# EAGLE design MicroMod-Datalogging-CarrierBoard (EAGLE 9.6.2)
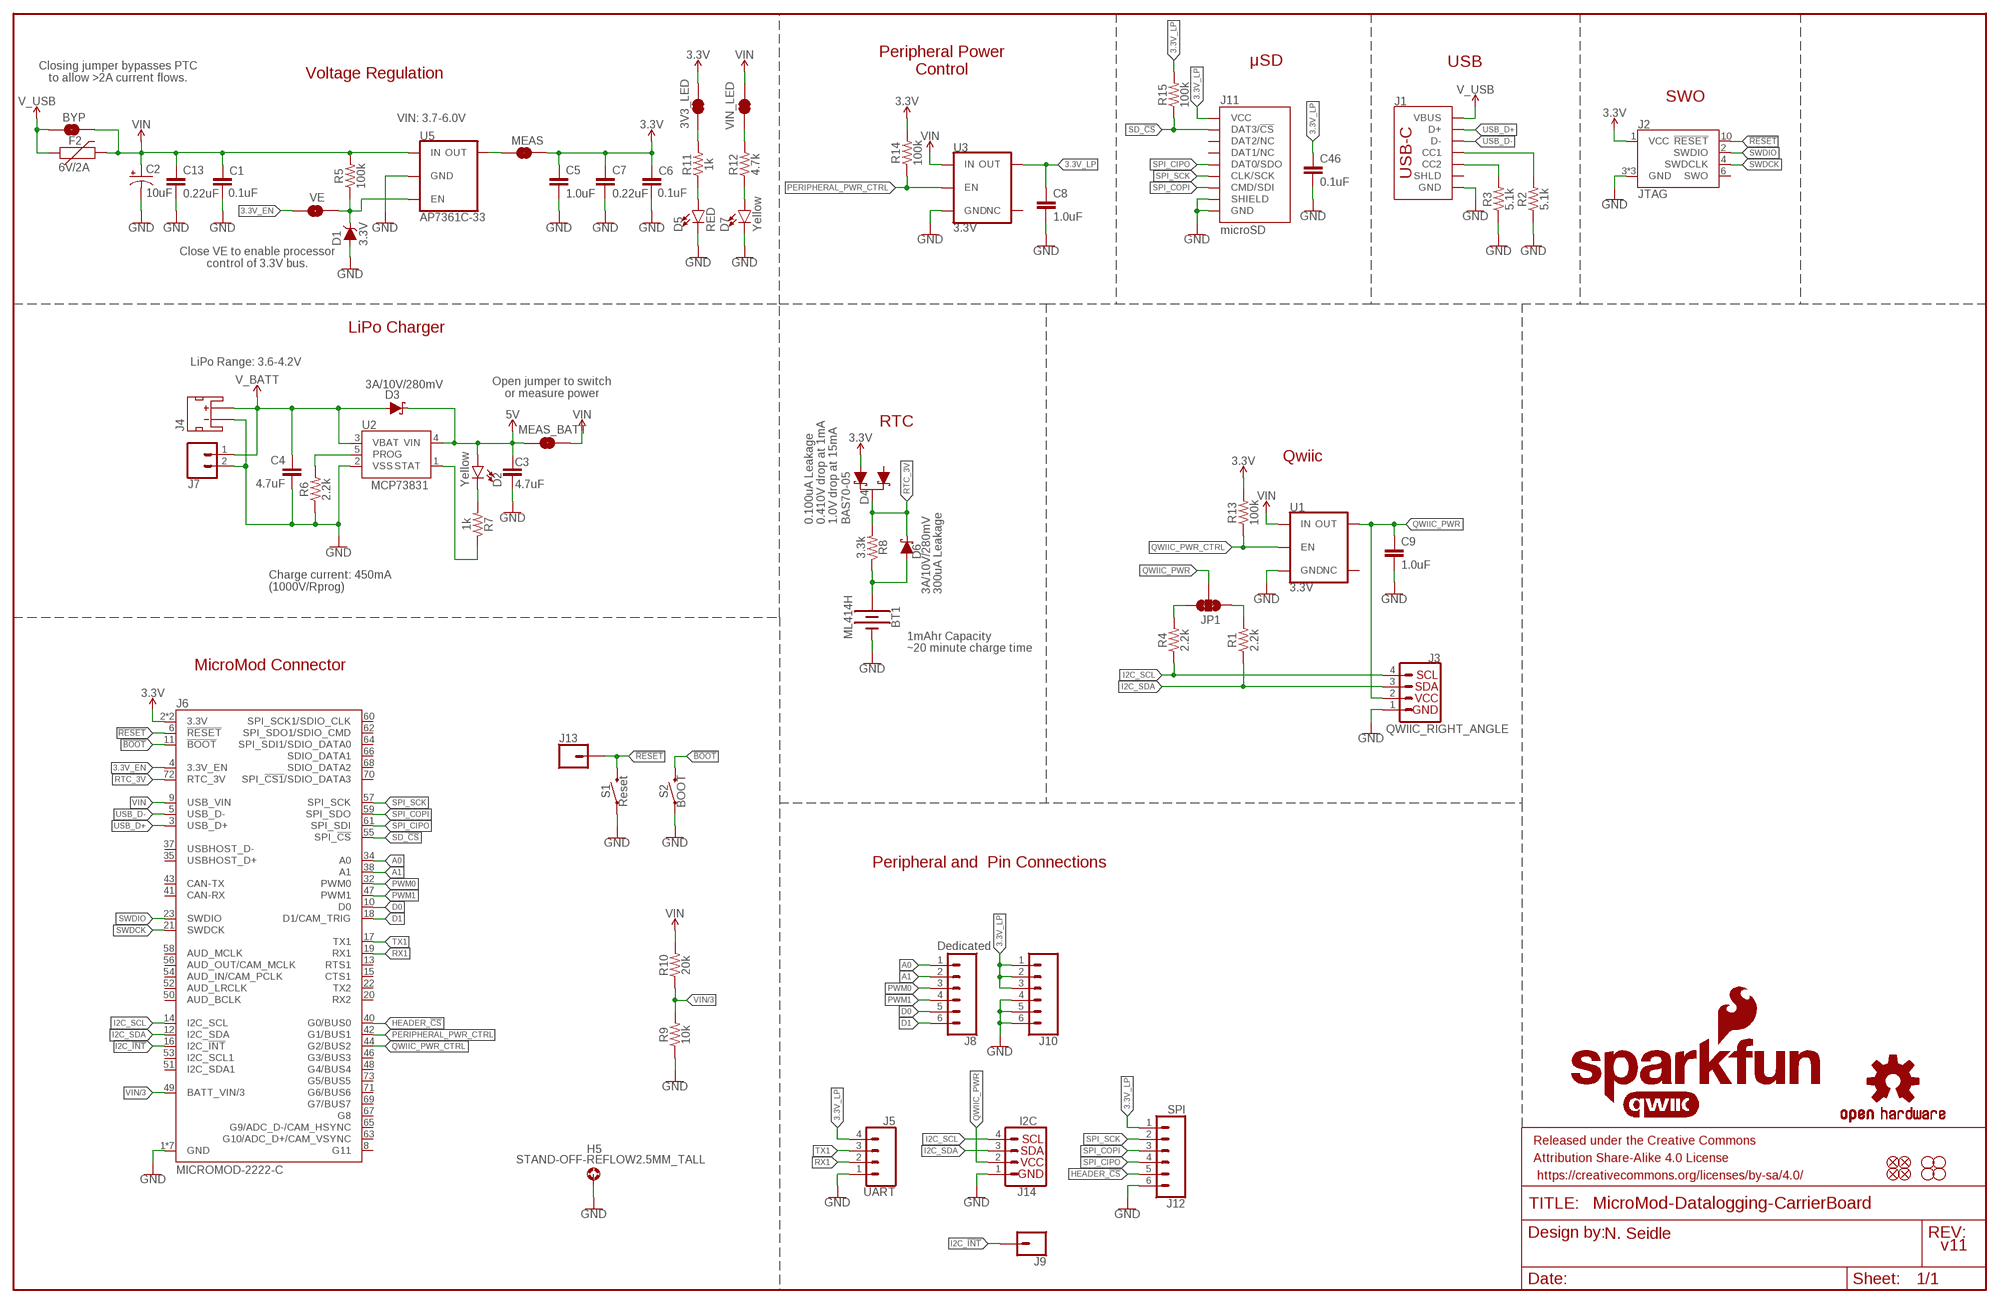
[diagram p0: schematic, sheet 1]

## Parts
3V3_LED  JUMPER-SMT_2_NC_TRACE_SILK  [SMT-JUMPER_2_NC_TRACE_SILK]
BT1  ML414H  ML414H_IV01E_BATTERY  [ML414H_IV01E]
BYP  JUMPER-SMT_2_NO_SILK  [SMT-JUMPER_2_NO_SILK]
C1  0.1uF  0.1UF-0603-25V-(+80/-20%)  [0603]
C2  10uF  10UF-POLAR-EIA3216-16V-10%(TANT)  [EIA3216]
C3  4.7uF  4.7UF-0603-35V-(20%)  [0603]
C4  4.7uF  4.7UF-0603-6.3V-(10%)  [0603]
C5  1.0uF  1.0UF-0603-16V-10%  [0603]
C6  0.1uF  0.1UF-0603-25V-(+80/-20%)  [0603]
C7  0.22uF  0.22UF-0603-25V-10%  [0603]
C8  1.0uF  1.0UF-0603-16V-10%  [0603]
C9  1.0uF  1.0UF-0603-16V-10%  [0603]
C13  0.22uF  0.22UF-0603-25V-10%  [0603]
C46  0.1uF  0.1UF-0603-25V-(+80/-20%)  [0603]
D1  3.3V  DIODE-ZENER-MM3Z3V3T1G  [SOD-323]
D2  Yellow  LED-YELLOW0603  [LED-0603]
D3  3A/10V/280mV  DIODE-SCHOTTKY-BAT60A  [SOD-323]
D4  BAS70-05  DIODE-SCHOTTKY-DUAL  [SOT23-3]
D5  RED  LED-RED0603  [LED-0603]
D6  3A/10V/280mV  DIODE-SCHOTTKY-BAT60A  [SOD-323]
D7  Yellow  LED-YELLOW0603  [LED-0603]
F2  6V/2A  PPTC_6V2A  [1210]
FD1  FIDUCIALUFIDUCIAL  [FIDUCIAL-MICRO]
FD2  FIDUCIALUFIDUCIAL  [FIDUCIAL-MICRO]
FD3  FIDUCIALUFIDUCIAL  [FIDUCIAL-MICRO]
FD4  FIDUCIALUFIDUCIAL  [FIDUCIAL-MICRO]
FRAME1  FRAME-LEDGER  [CREATIVE_COMMONS]
H1  STAND-OFF  [STAND-OFF]
H2  STAND-OFF  [STAND-OFF]
H3  STAND-OFF  [STAND-OFF]
H4  STAND-OFF  [STAND-OFF]
H5  STAND-OFF-REFLOW2.5MM_TALL  [STAND-OFF-REFLOW-M2.5]
J1  USB_C_2-LAYER_PADS  [USB-C-16P-2LAYER-PADS]
J2  JTAG  CORTEX_JTAG_DEBUG_MINIMUM_PTH  [2X5-PTH-1.27MM]
J3  QWIIC_RIGHT_ANGLE  QWIIC_CONNECTORJS-1MM  [JST04_1MM_RA]
J4  JST_2MM_MALE  [JST-2-SMD]
J5  UART  CONN_041X04_NO_SILK  [1X04_NO_SILK]
J6  MICROMOD-2222-C  [M.2-CONNECTOR-E]
J7  CONN_021X02_NO_SILK  [1X02_NO_SILK]
J8  Dedicated  CONN_06NO_SILK_NO_POP  [1X06_NO_SILK]
J9  CONN_01PTH_NO_SILK_YES_STOP  [1X01_NO_SILK]
J10  CONN_06NO_SILK_NO_POP  [1X06_NO_SILK]
J11  microSD  MICRO-SD-SDIOPUSH-PUSH  [MICRO-SD-SOCKET]
J12  SPI  CONN_06NO_SILK_NO_POP  [1X06_NO_SILK]
J13  CONN_01PTH_NO_SILK_YES_STOP  [1X01_NO_SILK]
J14  I2C  I2C_STANDARD_NO_SILK  [1X04_NO_SILK]
JP1  JUMPER-SMT_3_2-NC_TRACE_SILK  [SMT-JUMPER_3_2-NC_TRACE_SILK]
LOGO1  SFE_LOGO_NAME_FLAME.1_INCH  [SFE_LOGO_NAME_FLAME_.1]
LOGO2  QWIIC_LOGO_CONNECTOR  [QWIIC_5.5MM]
LOGO3  OSHW-LOGOMINI  [OSHW-LOGO-MINI]
MEAS  JUMPER-COMBO_2_NC_TRACE  [COMBO-JUMPER_2_NC_TRACE]
MEAS_BATT  JUMPER-COMBO_2_NC_TRACE  [COMBO-JUMPER_2_NC_TRACE]
R1  2.2k  2.2KOHM-0603-1/10W-1%  [0603]
R2  5.1k  5.1KOHM5.1KOHM-0603-1/10W-1%  [0603]
R3  5.1k  5.1KOHM5.1KOHM-0603-1/10W-1%  [0603]
R4  2.2k  2.2KOHM-0603-1/10W-1%  [0603]
R5  100k  100KOHM-0603-1/10W-1%  [0603]
R6  2.2k  2.2KOHM-0603-1/10W-1%  [0603]
R7  1k  1KOHM-0603-1/10W-1%  [0603]
R8  3.3k  3.3KOHM-0603-1/10W-1%  [0603]
R9  10k  10KOHM-0603-1/10W-1%  [0603]
R10  20k  20KOHM-0603-1/10W-1%  [0603]
R11  1k  1KOHM-0603-1/10W-1%  [0603]
R12  4.7k  4.7KOHM-0603-1/10W-1%  [0603]
R13  100k  100KOHM-0603-1/10W-1%  [0603]
R14  100k  100KOHM-0603-1/10W-1%  [0603]
R15  100k  100KOHM-0603-1/10W-1%  [0603]
S1  Reset  MOMENTARY-SWITCH-SPST-SMD-5.2-TALL-REDUNDANT  [TACTILE_SWITCH_SMD_5.2MM]
S2  BOOT  MOMENTARY-SWITCH-SPST-SMD-5.2-TALL-REDUNDANT  [TACTILE_SWITCH_SMD_5.2MM]
U1  3.3V  V_REG_AP2112K-3.3V  [SOT23-5]
U2  MCP73831  [SOT23-5]
U3  3.3V  V_REG_AP2112K-3.3V  [SOT23-5]
U5  AP7361C-33  AP7361C-33FGEUDFN-8  [UDFN-8]
VE  JUMPER-SMT_2_NO_SILK  [SMT-JUMPER_2_NO_SILK]
VIN_LED  JUMPER-SMT_2_NC_TRACE_SILK  [SMT-JUMPER_2_NC_TRACE_SILK]

## Nets
3.3V: 3V3_LED.2 C5.1 C6.1 C7.1 D4.2(A1) J2.1(VCC) J6.2(3.3V) J6.74(3.3V) MEAS.2 MEAS.4 R13.2 R14.2
3.3V_EN: J6.4(3.3V_EN) VE.1
3.3V_EN_VE: D1.C R5.1 U5.5(EN) VE.2
3.3V_LP: C8.1 C46.1 J5.4 J10.1 J10.2 J10.3 J11.VCC J12.1 R15.2 U3.5(OUT)
5V: C3.1 D2.A D3.C MEAS_BATT.1 MEAS_BATT.3 U2.4(VIN)
!BOOT!: J6.11(!BOOT!) S2.3 S2.4
!RESET!: J2.10(!RESET) J6.6(!RESET!) J13.1 S1.3 S1.4
A0: J6.34(A0) J8.1
A1: J6.38(A1) J8.2
CHG_LED: R7.1 U2.1(STAT)
D0: J6.10(D0) J8.5
D1: J6.18(D1/CAM_TRIG) J8.6
GND: BT1.- C1.2 C2.- C3.2 C4.2 C5.2 C6.2 C7.2 C8.2 C9.2 C13.2 C46.2 D1.A D5.C D7.C H5.1 J1.GND J1.GND2(GND) J2.3(GND) J2.5(GND) J2.9(GND) J3.1 J4.1(-) J5.1 J6.1(GND) J6.7(GND) J6.33(GND) J6.36(GND) J6.39(GND) J6.45(GND) J6.75(GND) J7.2 J10.4 J10.5 J10.6 J11.CD1(SHIELD) J11.GND J11.GND1(GND) J11.GND3(GND) J12.6 J14.1 R2.1 R3.1 R6.1 R9.1 S1.1 S1.2 S2.1 S2.2 U1.2(GND) U2.2(VSS) U3.2(GND) U5.4(GND) U5.EP(GND)
HEADER_!CS!: J6.40(G0/BUS0) J12.5
I2C_!INT!: J6.16(I2C_!INT!) J9.1
I2C_SCL: J3.4 J6.14(I2C_SCL) J14.4 R4.1
I2C_SDA: J3.3 J6.12(I2C_SDA) J14.3 R1.1
N$1: MEAS.1 MEAS.3 U5.1(OUT)
N$2: JP1.3 R4.2
N$3: JP1.1 R1.2
N$4: D2.C R7.2
N$5: D5.A R11.1
N$6: 3V3_LED.1 R11.2
N$7: R6.2 U2.5(PROG)
N$8: R12.2 VIN_LED.1
N$9: D7.A R12.1
N$10: J1.A5(CC1) R2.2
N$11: J1.B5(CC2) R3.2
N$14: BT1.+ D6.A R8.1
PERIPHERAL_PWR_CTRL: J6.42(G1/BUS1) R14.1 U3.3(EN)
PWM0: J6.32(PWM0) J8.3
PWM1: J6.47(PWM1) J8.4
QWIIC_PWR: C9.1 J3.2 J14.2 JP1.2 U1.5(OUT)
QWIIC_PWR_CTRL: J6.44(G2/BUS2) R13.1 U1.3(EN)
RTC_3V: D4.3(C) D6.C J6.72(RTC_3V) R8.2
RX1: J5.2 J6.19(RX1)
SD_!CS!: J6.55(SPI_!CS!) J11.CS/DAT3(DAT3/!CS!) R15.1
SPI_CIPO: J6.61(SPI_SDI) J11.DO/DAT0(DAT0/SDO) J12.4
SPI_COPI: J6.59(SPI_SDO) J11.DI/CMD(CMD/SDI) J12.3
SPI_SCK: J6.57(SPI_SCK) J11.SCLK(CLK/SCK) J12.2
SWDCK: J2.4(SWDCLK) J6.21(SWDCK)
SWDIO: J2.2(SWDIO) J6.23(SWDIO)
TX1: J5.3 J6.17(TX1)
USB_D+: J1.A6(D+) J1.B6(D+) J6.3(USB_D+)
USB_D-: J1.A7(D-) J1.B7(D-) J6.5(USB_D-)
V_BATT: C4.1 D3.A J4.2(+) J7.1 U2.3(VBAT)
V_USB: BYP.1 F2.1 J1.VBUS1(VBUS) J1.VBUS2(VBUS)
VIN: BYP.2 C1.1 C2.+ C13.1 F2.2 J6.9(USB_VIN) MEAS_BATT.2 MEAS_BATT.4 R5.2 R10.2 U1.1(IN) U3.1(IN) U5.8(IN) VIN_LED.2
VIN/3: J6.49(BATT_VIN/3) R9.2 R10.1
Unconnected: D4.1(A) J1.SHLD1(SHLD) J1.SHLD2(SHLD) J1.SHLD3(SHLD) J1.SHLD4(SHLD) J2.6(SWO) J4.NC1(PAD1) J4.NC2(PAD2) J6.8(G11) J6.13(RTS1) J6.15(CTS1) J6.20(RX2) J6.22(TX2) J6.35(USBHOST_D+) J6.37(USBHOST_D-) J6.41(CAN-RX) J6.43(CAN-TX) J6.46(G3/BUS3) J6.48(G4/BUS4) J6.50(AUD_BCLK) J6.51(I2C_SDA1) J6.52(AUD_LRCLK) J6.53(I2C_SCL1) J6.54(AUD_IN/CAM_PCLK) J6.56(AUD_OUT/CAM_MCLK) J6.58(AUD_MCLK) J6.60(SPI_SCK1/SDIO_CLK) J6.62(SPI_SDO1/SDIO_CMD) J6.63(G10/ADC_D+/CAM_VSYNC) J6.64(SPI_SDI1/SDIO_DATA0) J6.65(G9/ADC_D-/CAM_HSYNC) J6.66(SDIO_DATA1) J6.67(G8) J6.68(SDIO_DATA2) J6.69(G7/BUS7) J6.70(SPI_!CS1!/SDIO_DATA3) J6.71(G6/BUS6) J6.73(G5/BUS5) J11.DAT1(DAT1/NC) J11.DAT2(DAT2/NC) U1.4(NC) U3.4(NC)

## Notes on the sheet
- Peripheral Power
  Control
- μSD | USB
- Closing jumper bypasses PTC
  to allow >2A current flows.
- Voltage Regulation
- SWO
- VIN: 3.7-6.0V
- Close VE to enable processor
  control of 3.3V bus.
- LiPo Charger
- LiPo Range: 3.6-4.2V
- Open jumper to switch
  or measure power
- RTC
- Qwiic
- 0.100uA Leakage
  0.410V drop at 1mA
  1.0V drop at 15mA
- Charge current: 450mA
  (1000V/Rprog)
- 300uA Leakage
- 1mAhr Capacity
- ~20 minute charge time
- MicroMod Connector
- Peripheral and  Pin Connections
- N. Seidle
- v11

## Library data of the parts
3V3_LED VIN_LED = SparkFun-Jumpers:JUMPER-SMT_2_NC_TRACE: Normally closed trace jumper This jumper has a trace between two pads so it's normally closed (NC). Use a razor knife to open the connection. For best results follow the IPC guidelines for cutting traces: Cutout at least 0.063 mm (0.005 in). Remove all loose material to clean up the cut area. Seal the cut with an approved epoxy. Reapply solder to reclose the connection.
BT1 = SparkFun-Batteries:ML414H_IV01E_BATTERY: SEIKO ML414H-IV01E Reflowable Lithium Battery ML414H is a rechargeable, coin type battery with features such as Pb-free reflowable (Peak temperature: 260 C) and high temperature heat resistance. Battery Characteristics: 3.1V max voltage Voff is 2V 1mAH 3k series resistor with battery 72 hour charge time from 2.0-3.1V 2.3-2.8V initial charge; PROD_ID: BATT-14267
BYP VE = SparkFun-Jumpers:JUMPER-SMT_2_NO: Normally open jumper This jumper has two pads in close proximity to each other. Apply solder to close the connection. Round pads are easier to solder for beginners, but are a lot larger. SparkFun Product that uses the round pads: SparkFun EL Sequencer <https://www.sparkfun.com/products/12781>
C1 C6 C46 = SparkFun-Capacitors:0.1UF: 0.1µF ceramic capacitors A capacitor is a passive two-terminal electrical component used to store electrical energy temporarily in an electric field.; PROD_ID: CAP-00810
C2 = SparkFun-Capacitors:10UF-POLAR: 10.0µF polarized capacitors A capacitor is a passive two-terminal electrical component used to store electrical energy temporarily in an electric field.; PROD_ID: CAP-00811
C3 = SparkFun-Capacitors:4.7UF: 4.7µF ceramic capacitors A capacitor is a passive two-terminal electrical component used to store electrical energy temporarily in an electric field.; PROD_ID: CAP-14106
C4 = SparkFun-Capacitors:4.7UF: 4.7µF ceramic capacitors A capacitor is a passive two-terminal electrical component used to store electrical energy temporarily in an electric field.; PROD_ID: CAP-08280
C5 C8 C9 = SparkFun-Capacitors:1.0UF: 1µF ceramic capacitors A capacitor is a passive two-terminal electrical component used to store electrical energy temporarily in an electric field.; PROD_ID: CAP-00868
C7 C13 = SparkFun-Capacitors:0.22UF: 0.22µF ceramic capacitors A capacitor is a passive two-terminal electrical component used to store electrical energy temporarily in an electric field.; PROD_ID: CAP-07822
D1 = SparkFun-DiscreteSemi:DIODE-ZENER: Zener Diode A Zener diode allows current to flow from its anode to its cathode like a normal semiconductor diode, but it also permits current to flow in the reverse direction when its "Zener voltage" is reached. - WIkipedia; PROD_ID: DIO-11284
D2 D7 = SparkFun-LED:LED-YELLOW: Yellow SMD LED Used in manufacturing several products at SparkFun. Packages: 0603 - SMD 0603 package[Product Link] <http://www.kingbrightusa.com/product.asp?catalog_name=LED&product_id=APT1608SYCK> 0603 -SMART - SMART SMD 0603 package (more efficient/more expensive) [Product Link] <http://www.osram-os.com/osram_os/en/products/product-catalog/led-light-emitting-diodes/smartled-0603/ly-l29k/index.jsp> LilyPad - SMD1206 package[Product Datasheet] <https://www.sparkfun.com/datasheets/DevTools/LilyPad/Q150YUS4.pdf> SparkFun Products: Blynk Board <https://www.sparkfun.com/products/13794> IOIO-OTG <https://www.sparkfun.com/products/13613> XBee Explorer Serial <https://www.sparkfun.com/products/13225>; PROD_ID: DIO-09003
D3 D6 = SparkFun-DiscreteSemi:DIODE-SCHOTTKY: Schottky diode A Schottky diode is a semiconductor diode which has a low forward voltage drop and a very fast switching action.; PROD_ID: DIO-14072
D4 = SparkFun-DiscreteSemi:DIODE-SCHOTTKY-DUAL: Diodes Incorporated - BAS70-05 Dual Schottky Diode Two Schottky Diodes in a single SOT-23 package. Low reverse current (100 nA) Vf: Datasheet referenced for footprint <https://www.diodes.com/assets/Datasheets/ds11007.pdf>; PROD_ID: DIO-14829
D5 = SparkFun-LED:LED-RED: Red SMD LED Used in manufacturing of most products at SparkFun Packages: 0603 - SMD 0603 package [Product Link] <http://docs.avagotech.com/docs/AV02-0551EN> 0603 SMART - SMD 0603 SMART package ( more efficient and expensive)[Product Link] <http://www.osram-os.com/Graphics/XPic2/00077099_0.pdf> 1206 - SMD1206 package [Product Link] <https://www.sparkfun.com/datasheets/DevTools/LilyPad/Q150OVS4.pdff> SparkFun Products: Pro Mini 328 -5V <https://www.sparkfun.com/products/821> RedBoard <https://www.sparkfun.com/products/12757> IOIO-OTG <https://www.sparkfun.com/products/13613>; PROD_ID: DIO-00819
F2 = SparkFun-Fuses:PPTC: Resettable Fuse PPTC Resettable Fuse. Really a sort of resistor with a polymeric positive temperature coefficient whose resistance increases dramatically with an increase in temperature. When heated by the power passing through the resistance rises causing the current to be limited, protecting the circuit. This is achieved by the transition of the polymer from a crystalline to an amorphous state where the conductive carbon separates breaking the conductive pathways found in the cool crystalline structure. When a PPTC cools back down it resumes conducting letting the circuit turn back on. SparkFun Products: SparkFun RedBoard - Programmed with Arduino <https://www.sparkfun.com/products/12757> Pro Micro - 5V/16MHz <https://www.sparkfun.com/products/12640> Arduino Pro 328 - 5V/16MHz <https://www.sparkfun.com/products/10915> MP3 Trigger <https://www.sparkfun.com/products/13720>; PROD_ID: RES-14313
FD1-FD4 = SparkFun-Aesthetics:FIDUCIAL: Fiducial Alignment Points Point-of-reference for pick-and-place machines and other optical instruments.
FRAME1 = SparkFun-Aesthetics:FRAME-LEDGER: Schematic Frame - Ledger Standard 11x14 US Ledger frame
H1-H4 = SparkFun-Hardware:STAND-OFF: Stand Off Drill holes for mechanically mounting via screws, standoffs, etc. Note: Use the keepout ring to avoid running the screw head into surrounding components. Variant Overviews STAND-OFF - Mechanical footprint for a #4 phillips button head screw. STAND-OFF-TIGHT - Mechanical footprint for a #4 phillips button head screw, Example SparkFun Products Screw - Phillips Head (1/4", 4-40, 10 pack) <https://www.sparkfun.com/products/10453> (PRT-10453) Screw - Phillips Head (1/2", 4-40, 10 pack) <https://www.sparkfun.com/products/10452> (PRT-10452) Screw - Phillips Head (3/4", 4-40, 10 pack) <https://www.sparkfun.com/products/10451> (PRT-10451) Screw - Phillips Head (1", 4-40, 10 pack) <https://www.sparkfun.com/products/10450> (PRT-10450)
H5 = SparkFun-Hardware:STAND-OFF-REFLOW: Stand Off Reflow Compatible A metal standoff that can be placed and reflowed onto a PCB.; PROD_ID: HW-14899
J1 = SparkFun-Connectors:USB_C: USB Type C 16Pin Connector Super Speed pins not available on the 16-pin purely SMD connector so this part is best for USB 2.0 implementations. D1 and D2 are tied together enabling D+/- no matter which way the cable is plugged into the connector. The two channel configuration pins (CC1/2) are exposed. These are normally connected to ground via 5.1k resistors but can be reconfigured for high current/high power applications.; PROD_ID: CONN-14122
J2 = SparkFun-Connectors:CORTEX_JTAG_DEBUG_MINIMUM: Cortex Debug Connector - 10 pin Supports JTAG debug, Serial Wire debug, and Serial Wire Viewer. PTH and SMD connector options available. General Connector Information <http://infocenter.arm.com/help/topic/com.arm.doc.faqs/attached/13634/cortex_debug_connectors.pdf> Products: PTH Connector <http://www.digikey.com/product-detail/en/cnc-tech/3220-10-0100-00/1175-1627-ND/3883661> -via Digi-Key SparkFun PSoc <https://www.sparkfun.com/products/13229> SparkFun T <https://www.sparkfun.com/products/13810>
J3 = SparkFun-Connectors:QWIIC_CONNECTOR: SparkFun I2C Standard Qwiic Connector An SMD 1mm pitch JST connector makes it easy and quick (get it? Qwiic?) to connect I2C devices to each other. The Qwiic system <http://www.sparkfun.com/qwiic> enables fast and solderless connection between popular platforms and various sensors and actuators. We carry 200mm <https://www.sparkfun.com/products/14204>, 100mm <https://www.sparkfun.com/products/14205>, 50mm <https://www.sparkfun.com/products/14206>, and breadboard friendly <https://www.sparkfun.com/products/14207> Qwiic cables. We also offer 10 pcs strips <https://www.sparkfun.com/products/14323> the SMD connectors.; PROD_ID: CONN-13694
J4 = SparkFun-Connectors:JST_2MM_MALE: JST 2MM MALE RA CONNECTOR Two pin, compact surface mount connector. Commonly used as a battery input connection point. We really like the solid locking feeling and high current rating on these small connectors. We use these all the time as battery connectors. Mates to single-cell LiPo batteries. Here is the connector we sell at SparkFun: JST Right Angle Connector - White <https://www.sparkfun.com/products/8612> (PRT-08612) Datasheet <http://www.sparkfun.com/datasheets/Prototyping/Connectors/JST-Horizontal.pdf> It was used on these SparkFun products: SparkFun MOSFET Power Controller <https://www.sparkfun.com/products/11214> (PRT-11214) SparkFun Battery Babysitter - LiPo Battery Manager <https://www.sparkfun.com/products/13777> (PRT-13777) And many, many others that required a lipo battery connection.; PROD_ID: CONN-11443; SF_ID: PRT-08612
J5 = SparkFun-Connectors:CONN_04: Multi connection point. Often used as Generic Header-pin footprint for 0.1 inch spaced/style header connections On any of the 0.1 inch spaced packages, you can populate with these: Break Away Headers - Straight <https://www.sparkfun.com/products/116> (PRT-00116) Break Away Male Headers - Right Angle <https://www.sparkfun.com/products/553> (PRT-00553) Female Headers <https://www.sparkfun.com/products/115> (PRT-00115) Break Away Headers - Machine Pin <https://www.sparkfun.com/products/117> (PRT-00117) Break Away Female Headers - Swiss Machine Pin <https://www.sparkfun.com/products/743> (PRT-00743) For SCREWTERMINALS and SPRING TERMINALS visit here: Screw Terimnals on SparkFun.com <https://www.sparkfun.com/search/results?term=Screw+Terminals> (5mm/3.5mm/2.54mm spacing) This device is also useful as a general connection point to wire up your design to another part of your project. Our various solder wires solder well into these plated through hole pads. Hook-Up Wire - Assortment (Stranded, 22 AWG) <https://www.sparkfun.com/products/11375> (PRT-11375) Hook-Up Wire - Assortment (Solid Core, 22 AWG) <https://www.sparkfun.com/products/11367> (PRT-11367) View the entire wire category on our website here <https://www.sparkfun.com/categories/141> Special notes: Molex polarized connector foot print use with SKU : PRT-08231 with associated crimp pins and housings. 1MM SMD Version SKU: PRT-10208; PROD_ID: CONN-09696
J6 = SparkFun-MicroMod:MICROMOD: MicroMod Connector Description: A card edge connector and mating PCB connector to allow various MicroMod Processor Boards to be coupled with various carrier boards of different capabilities. Based on the M.2 standard.; PROD_ID: CONN-14877
J7 = SparkFun-Connectors:CONN_02: Multi connection point. Often used as Generic Header-pin footprint for 0.1 inch spaced/style header connections On any of the 0.1 inch spaced packages, you can populate with these: Break Away Headers - Straight <https://www.sparkfun.com/products/116> (PRT-00116) Break Away Male Headers - Right Angle <https://www.sparkfun.com/products/553> (PRT-00553) Female Headers <https://www.sparkfun.com/products/115> (PRT-00115) Break Away Headers - Machine Pin <https://www.sparkfun.com/products/117> (PRT-00117) Break Away Female Headers - Swiss Machine Pin <https://www.sparkfun.com/products/743> (PRT-00743) For SCREWTERMINALS and SPRING TERMINALS visit here: Screw Terimnals on SparkFun.com <https://www.sparkfun.com/search/results?term=Screw+Terminals> (5mm/3.5mm/2.54mm spacing) This device is also useful as a general connection point to wire up your design to another part of your project. Our various solder wires solder well into these plated through hole pads. Hook-Up Wire - Assortment (Stranded, 22 AWG) <https://www.sparkfun.com/products/11375> (PRT-11375) Hook-Up Wire - Assortment (Solid Core, 22 AWG) <https://www.sparkfun.com/products/11367> (PRT-11367) View the entire wire category on our website here <https://www.sparkfun.com/categories/141> Special notes: Molex polarized connector foot print use with: PRT-08233 with associated crimp pins and housings. 2.54_SCREWTERM for use with PRT-10571. 3.5mm Screw Terminal footprints for PRT-08084 5mm Screw Terminal footprints for use with PRT-08432
J8 J10 J12 = SparkFun-Connectors:CONN_06: Multi connection point. Often used as Generic Header-pin footprint for 0.1 inch spaced/style header connections On any of the 0.1 inch spaced packages, you can populate with these: Break Away Headers - Straight <https://www.sparkfun.com/products/116> (PRT-00116) Break Away Male Headers - Right Angle <https://www.sparkfun.com/products/553> (PRT-00553) Female Headers <https://www.sparkfun.com/products/115> (PRT-00115) Break Away Headers - Machine Pin <https://www.sparkfun.com/products/117> (PRT-00117) Break Away Female Headers - Swiss Machine Pin <https://www.sparkfun.com/products/743> (PRT-00743) Arduino Stackable Header - 6 Pin <https://www.sparkfun.com/products/9280> (PRT-09280) For SCREWTERMINALS and SPRING TERMINALS visit here: Screw Terimnals on SparkFun.com <https://www.sparkfun.com/search/results?term=Screw+Terminals> (5mm/3.5mm/2.54mm spacing) This device is also useful as a general connection point to wire up your design to another part of your project. Our various solder wires solder well into these plated through hole pads. Hook-Up Wire - Assortment (Stranded, 22 AWG) <https://www.sparkfun.com/products/11375> (PRT-11375) Hook-Up Wire - Assortment (Solid Core, 22 AWG) <https://www.sparkfun.com/products/11367> (PRT-11367) View the entire wire category on our website here <https://www.sparkfun.com/categories/141>
J9 J13 = SparkFun-Connectors:CONN_01: Single connection point. Often used as Generic Header-pin footprint for 0.1 inch spaced/style header connections On any of the 0.1 inch spaced packages, you can populate with these: Break Away Headers - Straight <https://www.sparkfun.com/products/116> (PRT-00116) Break Away Male Headers - Right Angle <https://www.sparkfun.com/products/553> (PRT-00553) Female Headers <https://www.sparkfun.com/products/115> (PRT-00115) Break Away Headers - Machine Pin <https://www.sparkfun.com/products/117> (PRT-00117) Break Away Female Headers - Swiss Machine Pin <https://www.sparkfun.com/products/743> (PRT-00743) This device is also useful as a general connection point to wire up your design to another part of your project. Our various solder wires solder well into these plated through hole pads. Hook-Up Wire - Assortment (Stranded, 22 AWG) <https://www.sparkfun.com/products/11375> (PRT-11375) Hook-Up Wire - Assortment (Solid Core, 22 AWG) <https://www.sparkfun.com/products/11367> (PRT-11367) View the entire wire category on our website here <https://www.sparkfun.com/categories/141> Special notes: SMTSO-256-ET is a "flush mount" nut for a 4-40 screw. We mostly use this on specialty testbeds; it is a nice way to connect hardware to your PCB at an adjustable hieght. Also note, the SNAP packages are for using a snappable style connector. We sell a baggie of snaps and they are also used on two LilyPad designs: Snap Assortment - 30 pack (male and female) <https://www.sparkfun.com/products/11347> (DEV-11347) LilyPad Arduino SimpleSnap <https://www.sparkfun.com/products/10941> (DEV-10941) LilyPad SimpleSnap Protoboard <https://www.sparkfun.com/products/10940> (DEV-10940)
J11 = SparkFun-Connectors:MICRO-SD-SDIO: microSD Socket for Transflash Push-push type µSD socket. tDoc lines correctly indicate media card edge positions when inserting (unlocked, locked, depressed). NOTE: CD1 and CD2 are connected internally, and the default detect state of the socket is detect pin to ground. SparkFun Products: WAV Trigger <https://www.sparkfun.com/products/13660> CAN-Bus Shield <https://www.sparkfun.com/products/13262> SparkFun Level Shifing microSD Breakout <https://www.sparkfun.com/products/13743>; PROD_ID: CONN-07820
J14 = SparkFun-Connectors:I2C_STANDARD: SparkFun I2C Standard Pinout Header SparkFun has standardized on a pinout for all I2C based sensor breakouts. This pinout allows I2C boards to be plugged directly into the headers on Arduino Uno compatible boards, and to be daisy chained easily. Example SparkFun Products: SparkFun Atmospheric Sensor Breakout - BME280 <https://www.sparkfun.com/products/13676> SparkFun Altitude/Pressure Sensor Breakout - MPL3115A2 <https://www.sparkfun.com/products/11084> SparkFun TOF Range Finder Sensor - VL6180 <https://www.sparkfun.com/products/12785>
JP1 = SparkFun-Jumpers:JUMPER-SMT_3_2-NC_TRACE: Normally closed trace jumper (2 of 2 connections) This jumper has a trace between all three pads so they are normally closed (NC). Use a razor knife to open the connection(s). For best results follow the IPC guidelines for cutting traces: Cutout at least 0.063 mm (0.005 in). Remove all loose material to clean up the cut area. Seal the cut with an approved epoxy. Reapply solder to reclose the connection(s).
LOGO1 = SparkFun-Aesthetics:SFE_LOGO_NAME_FLAME: SparkFun Font Logo w/ Flame This is the SparkFun full logo. The logo on the schematic will always be the same size; the package variant is the height of the flame part of the logo. Default layer for the logo on the board is tSilk.
LOGO2 = SparkFun-Aesthetics:QWIIC_LOGO: Qwiic Logos for placement on schematic and PCB. The 5.5mm silk logo is best for placing next to Qwiic connector.
LOGO3 = SparkFun-Aesthetics:OSHW-LOGO: Open-Source Hardware (OSHW) Logo This logo indicates the piece of hardware it is found on incorporates a OSHW license and/or adheres to the definition of open source hardware found here: http://freedomdefined.org/OSHW
MEAS MEAS_BATT = SparkFun-Jumpers:JUMPER-COMBO_2_NC_TRACE
R1 R4 R6 = SparkFun-Resistors:2.2KOHM: 2.2kΩ resistor A resistor is a passive two-terminal electrical component that implements electrical resistance as a circuit element. Resistors act to reduce current flow, and, at the same time, act to lower voltage levels within circuits. - Wikipedia; PROD_ID: RES-08272
R2 R3 = SparkFun-Resistors:5.1KOHM; PROD_ID: RES-12083
R5 R13-R15 = SparkFun-Resistors:100KOHM: 100kΩ resistor A resistor is a passive two-terminal electrical component that implements electrical resistance as a circuit element. Resistors act to reduce current flow, and, at the same time, act to lower voltage levels within circuits. - Wikipedia; PROD_ID: RES-07828
R7 R11 = SparkFun-Resistors:1KOHM: 1kΩ resistor A resistor is a passive two-terminal electrical component that implements electrical resistance as a circuit element. Resistors act to reduce current flow, and, at the same time, act to lower voltage levels within circuits. - Wikipedia; PROD_ID: RES-07856
R8 = SparkFun-Resistors:3.3KOHM: 3.3kΩ resistor A resistor is a passive two-terminal electrical component that implements electrical resistance as a circuit element. Resistors act to reduce current flow, and, at the same time, act to lower voltage levels within circuits. - Wikipedia; PROD_ID: RES-07851
R9 = SparkFun-Resistors:10KOHM: 10kΩ resistor A resistor is a passive two-terminal electrical component that implements electrical resistance as a circuit element. Resistors act to reduce current flow, and, at the same time, act to lower voltage levels within circuits. - Wikipedia; PROD_ID: RES-00824
R10 = SparkFun-Resistors:20KOHM: 20kΩ resistor A resistor is a passive two-terminal electrical component that implements electrical resistance as a circuit element. Resistors act to reduce current flow, and, at the same time, act to lower voltage levels within circuits. - Wikipedia; PROD_ID: RES-09383
R12 = SparkFun-Resistors:4.7KOHM: 4.7kΩ resistor A resistor is a passive two-terminal electrical component that implements electrical resistance as a circuit element. Resistors act to reduce current flow, and, at the same time, act to lower voltage levels within circuits. - Wikipedia; PROD_ID: RES-07857
S1 S2 = SparkFun-Switches:MOMENTARY-SWITCH-SPST: Momentary Switch (Pushbutton) - SPST Normally-open (NO) SPST momentary switches (buttons, pushbuttons). Variants PTH-12MM - 12mm square, through-hole Momentary Pushbutton Switch - 12mm Square <https://www.sparkfun.com/products/9190> (COM-09190) PTH-6.0MM, PTH-6.0MM-KIT - 6.0mm square, through-hole Mini Pushbutton Switch <https://www.sparkfun.com/products/97> (COM-00097) KIT package intended for soldering kit's - only one side of pads' copper is exposed. PTH-RIGHT-ANGLE-KIT - Right-angle, through-hole Right Angle Tactile Button <https://www.sparkfun.com/products/10791> - Used on SparkFun BigTime Watch Kit <https://www.sparkfun.com/products/11734> SMD-12MM - 12mm square, surface-mount Tactile Button - SMD (12mm) <https://www.sparkfun.com/products/12993> (COM-12993) Used on SparkFun PicoBoard <https://www.sparkfun.com/products/11888> SMD-4.5MM - 4.5mm Square Trackball Switch Used on SparkFun Blackberry Trackballer Breakout <https://www.sparkfun.com/products/13169> SMD-4.6MMX2.8MM - 4.60mm x 2.80mm, surface mount Used on SparkFun SAMD21 Mini Breakout <https://www.sparkfun.com/products/13664> SMD-5.2MM, SMD-5.2-REDUNDANT - 5.2mm square, surface-mount Mini Pushbutton Switch - SMD <https://www.sparkfun.com/products/8720> (COM-08720) Used on Arduino Pro Mini <https://www.sparkfun.com/products/11114> REDUNDANT package connects both switch circuits together SMD-6.0X3.5MM - 6.0 x 3.5mm, surface mount Momentary Reset Switch SMD <https://www.sparkfun.com/products/8229> (COM-08229) SMD-6.2MM-TALL - 6.2mm square, surface mount Tactile Button - SMD (6mm) <https://www.sparkfun.com/products/12992> Used on SparkFun Digital Sandbox <https://www.sparkfun.com/products/12651> SMD-RIGHT-ANGLE - Right-angle, surface mount Used on SparkFun Block for Intel® Edison - Arduino <https://www.sparkfun.com/products/13036>; PROD_ID: SWCH-14139
U1 U3 = SparkFun-IC-Power:V_REG_AP2112: AP2112 - 600mA CMOS LDO Regulator w/ Enable The AP2112 is CMOS process low dropout linear regulator with enable function, the regulator delivers a guaranteed 600mA (min.) continuous load current. Features Output Voltage Accuracy: ±1.5% Output Current: 600mA (Min.) Foldback Short Current Protection: 50mA Enable Function to Turn ON/OFF VOUT Low Dropout Voltage (3.3V): 250mV (Typ.) @IOUT=600mA Excellent Load Regulation: 0.2%/A (Typ.) Excellent Line Regulation: 0.02%/V (Typ.) Low Quiescent Current: 55μA (Typ.) Low Standby Current: 0.01μA (Typ.) Low Output Noise: 50μVRMS PSRR: 100Hz -65dB, 1kHz -65dB OTSD Protection Stable with 1.0μF Flexible Cap: Ceramic, Tantalum and Aluminum Electrolytic Operation Temperature Range: -40°C to 85°C ESD: MM 400V, HBM 4000V; PROD_ID: VREG-12457
U2 = SparkFun-IC-Power:MCP73831: MCP73831T Li-Ion, Li-Pol Controller Miniature single cell, fully integrated Li-Ion, Li-polymer charge management controller Datasheet <http://ww1.microchip.com/downloads/en/DeviceDoc/20001984g.pdf> SparkFun Products: SparkFun ESP32 Thing <https://www.sparkfun.com/products/13907> SparkFun 9DoF Razor IMU M0 <https://www.sparkfun.com/products/14001>; PROD_ID: IC-09995
U5 = SparkFun-IC-Power:AP7361C-33FGE: AP7361C 3.3V LDO Regulator; PROD_ID: VREG-14094

## Net classes
0 default: width 0 mm, drill 0 mm
1 power: width 0.762 mm

## Board
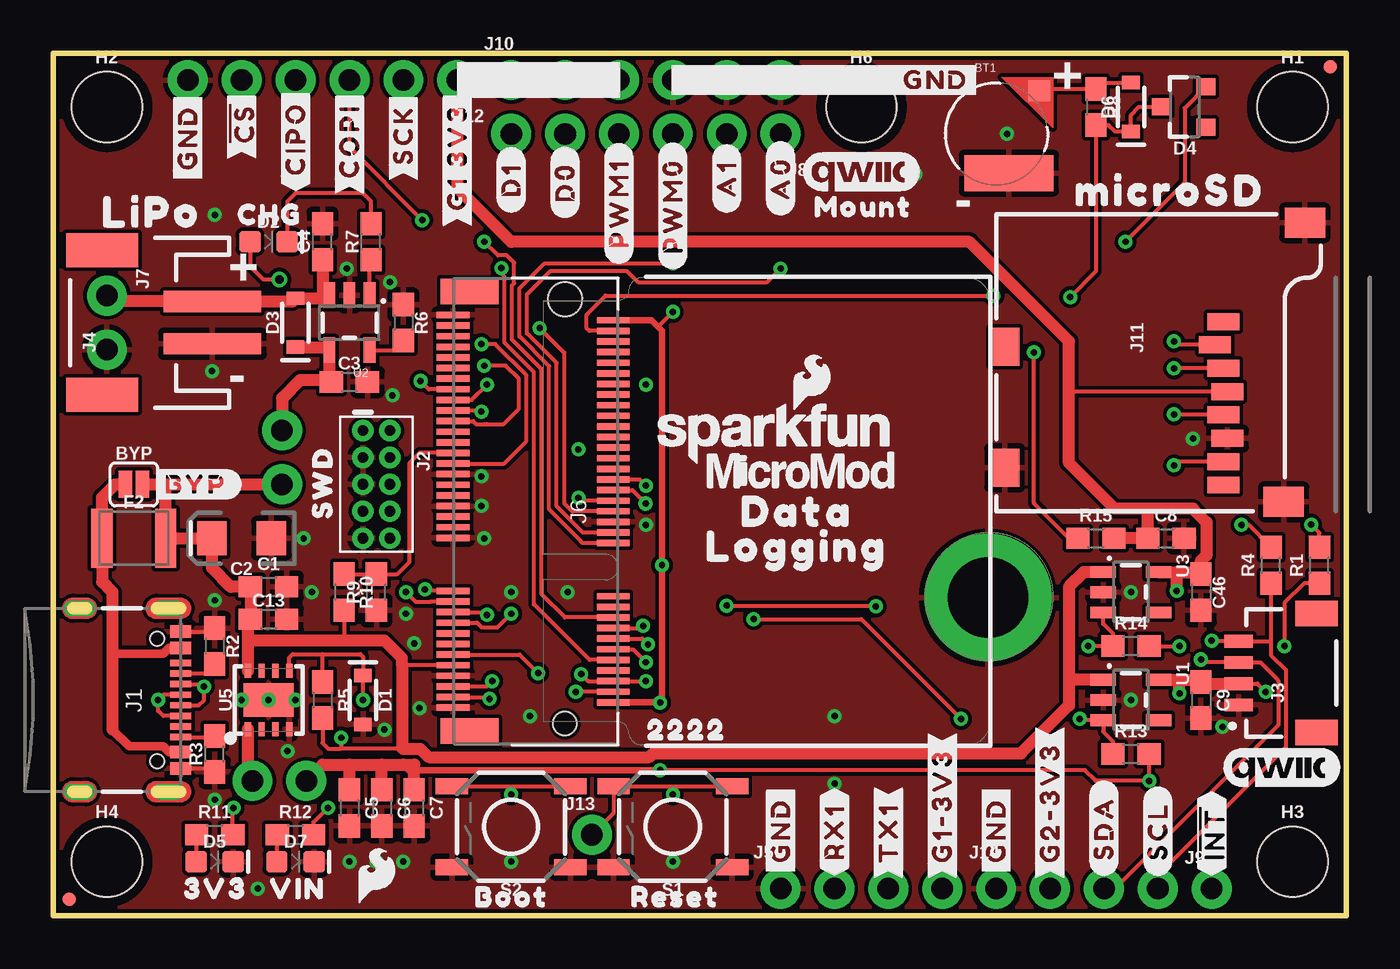
[diagram p1: board, top side]
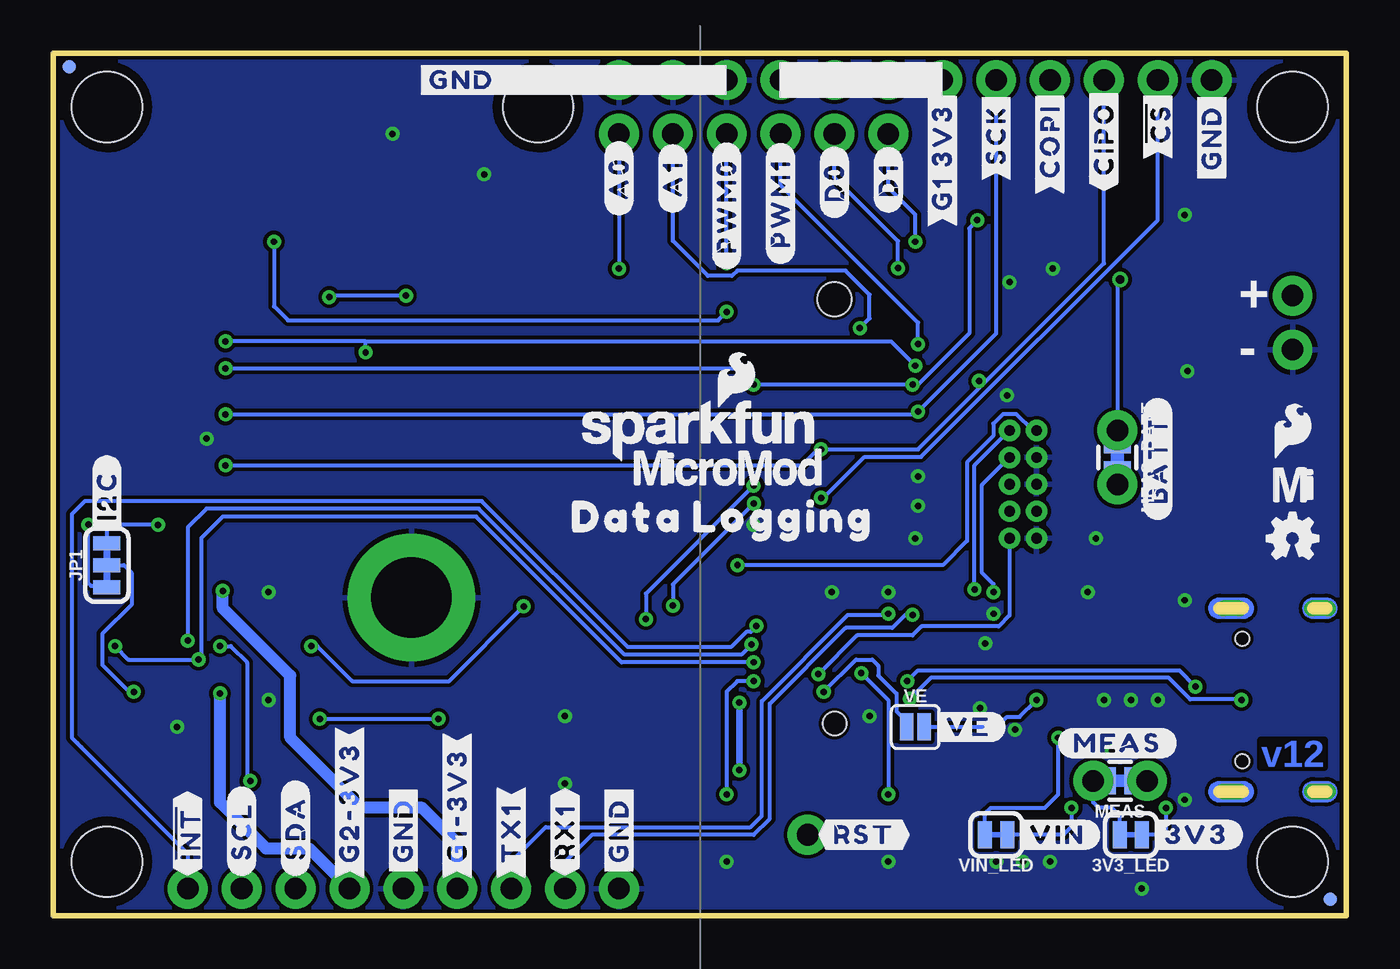
[diagram p2: board, bottom side, seen from below]

Size 60.96 x 40.64 mm. Coordinates in mm from the lower left corner, seen from the top.
Outline: 0,0 0,40.64 60.96,40.64 60.96,0 0,0
Copper layers (1*16): Top 0.035mm / dielectric 1.5mm / Bottom 0.035mm
Design rules "SparkFun-2-layer-TIGHT *": minimum track width 7mil, minimum drill 12mil, track to track 7mil, track to pad 7mil, pad to pad 7mil, via to via 7mil, smd to smd 7mil, copper to edge 7mil, drill to drill 7mil, minimum pad ring 7mil, minimum via ring 7mil, stop-mask expansion 4mil, vias tented up to drill 25mil, thermal gap 10mil

### Footprints (pad centres in the part's own frame; a part is rotated, then mirrored left to right if it is on the bottom)
SMT-JUMPER_2_NC_TRACE_SILK = smd 0.66 x 1.27: 1 -0.521,0; 2 0.521,0
ML414H_IV01E = smd 1 x 1: + 2.022,2.032 | smd 4.2 x 1.7: - 0.6,-1.85
SMT-JUMPER_2_NO_SILK = smd 0.635 x 1.27: 1 -0.406,0; 2 0.406,0
0603 = smd 1.1 x 1: 1 -0.85,0; 2 0.85,0
EIA3216 = smd 1.4 x 1.6: + 1.4,0; - -1.4,0
SOD-323 = smd 0.63 x 0.83: A 1.15,0; C -1.15,0
LED-0603 = smd 1 x 1: A -0.877,0; C 0.877,0
SOT23-3 = smd 0.8 x 0.9: 1 -0.95,-1; 2 0.95,-1; 3 0,1.1
1210 = smd 1 x 2.8: 1 -1.5,0; 2 1.5,0
FIDUCIAL-MICRO = smd 0.635 x 0.635: 1 0,0
STAND-OFF = hole 3.302: 0,0
STAND-OFF-REFLOW-M2.5 = drill 3.8 pad 6: 1 0,0
USB-C-16P-2LAYER-PADS = smd 0.3 x 1: A5 -1.25,-0.34; A6 -0.25,-0.34; A7 0.25,-0.34; A8 1.25,-0.34; B5 1.75,-0.34; B6 0.75,-0.34; B7 -0.75,-0.34; B8 -1.75,-0.34 | smd 0.6 x 1: GND -3.225,-0.34; GND2 3.225,-0.34; VBUS1 -2.45,-0.34; VBUS2 2.45,-0.34 | drill 0.4 pad 0.6 long: SHLD1 -4.318,-0.915; SHLD2 4.318,-0.915; SHLD3 -4.318,-5.095; SHLD4 4.318,-5.095 | hole 0.65: -2.89,-1.445; 2.89,-1.445
2X5-PTH-1.27MM = drill 0.508 pad 1: 1 -2.54,-0.635; 2 -2.54,0.635; 3 -1.27,-0.635; 4 -1.27,0.635; 5 0,-0.635; 6 0,0.635; 7 1.27,-0.635; 8 1.27,0.635; 9 2.54,-0.635; 10 2.54,0.635
JST04_1MM_RA = smd 0.6 x 1.35: 1 -1.5,0; 2 -0.5,0; 3 0.5,0; 4 1.5,0 | smd 1.2 x 2: NC1 2.8,-3.675; NC2 -2.8,-3.675
JST-2-SMD = smd 1 x 4.6: 1 -1,-3.7; 2 1,-3.7 | smd 1.6 x 3.4: NC1 -3.4,1.5; NC2 3.4,1.5
1X04_NO_SILK = drill 1.016 pad 1.88: 1 0,0; 2 2.54,0; 3 5.08,0; 4 7.62,0
M.2-CONNECTOR-E = smd 0.3 x 1.55: 1 9.25,-5.275; 2 9,2.275; 3 8.75,-5.275; 4 8.5,2.275; 5 8.25,-5.275; 6 8,2.275; 7 7.75,-5.275; 8 7.5,2.275; 9 7.25,-5.275; 10 7,2.275; 11 6.75,-5.275; 12 6.5,2.275; 13 6.25,-5.275; 14 6,2.275; 15 5.75,-5.275; 16 5.5,2.275; 17 5.25,-5.275; 18 5,2.275; 19 4.75,-5.275; 20 4.5,2.275; 21 4.25,-5.275; 22 4,2.275; 23 3.75,-5.275; 32 1.5,2.275; 33 1.25,-5.275; 34 1,2.275; 35 0.75,-5.275; 36 0.5,2.275; 37 0.25,-5.275; 38 0,2.275; 39 -0.25,-5.275; 40 -0.5,2.275; 41 -0.75,-5.275; 42 -1,2.275; 43 -1.25,-5.275; 44 -1.5,2.275; 45 -1.75,-5.275; 46 -2,2.275; 47 -2.25,-5.275; 48 -2.5,2.275; 49 -2.75,-5.275; 50 -3,2.275; 51 -3.25,-5.275; 52 -3.5,2.275; 53 -3.75,-5.275; 54 -4,2.275; 55 -4.25,-5.275; 56 -4.5,2.275; 57 -4.75,-5.275; 58 -5,2.275; 59 -5.25,-5.275; 60 -5.5,2.275; 61 -5.75,-5.275; 62 -6,2.275; 63 -6.25,-5.275; 64 -6.5,2.275; 65 -6.75,-5.275; 66 -7,2.275; 67 -7.25,-5.275; 68 -7.5,2.275; 69 -7.75,-5.275; 70 -8,2.275; 71 -8.25,-5.275; 72 -8.5,2.275; 73 -8.75,-5.275; 74 -9,2.275; 75 -9.25,-5.275 | smd 1.2 x 2.75: A1 10.35,-4.5; A2 -10.35,-4.5 | hole 1.1: 10,0 | hole 1.6: -10,0
1X02_NO_SILK = drill 1.016 pad 1.88: 1 0,0; 2 2.54,0
1X06_NO_SILK = drill 1.016 pad 1.88: 1 0,0; 2 2.54,0; 3 5.08,0; 4 7.62,0; 5 10.16,0; 6 12.7,0
1X01_NO_SILK = drill 1.016 pad 1.88: 1 0,0
MICRO-SD-SOCKET = smd 1.8 x 1.4: CD1 -2.05,0.4; CD2 -7.75,0.4 | smd 0.8 x 1.5: CS/DAT3 -7.84,10.3; DAT1 -1.24,10.7; DAT2 -8.94,10.7; DI/CMD -6.74,10.7; DO/DAT0 -2.34,10.7; GND -3.44,10.9; SCLK -4.54,10.7; VCC -5.64,10.9 | smd 1.4 x 1.9: GND1 -13.6,14.55; GND3 -0.45,13.55
SMT-JUMPER_3_2-NC_TRACE_SILK = smd 0.66 x 1.27: 1 -1.041,0; 2 0,0; 3 1.041,0
COMBO-JUMPER_2_NC_TRACE = smd 0.635 x 1.27: 1 -0.508,0; 2 0.508,0 | drill 1.016 pad 1.88: 3 -1.27,0; 4 1.27,0
TACTILE_SWITCH_SMD_5.2MM = smd 1.524 x 0.762: 1 -2.794,1.905; 2 2.794,1.905; 3 -2.794,-1.905; 4 2.794,-1.905
SOT23-5 = smd 0.55 x 1.2: 1 -0.95,-1.3; 2 0,-1.3; 3 0.95,-1.3; 4 0.95,1.3; 5 -0.95,1.3
UDFN-8 = smd 0.3 x 0.65: 1 -0.975,-1.375; 2 -0.325,-1.375; 3 0.325,-1.375; 4 0.975,-1.375; 5 0.975,1.375; 6 0.325,1.375; 7 -0.325,1.375; 8 -0.975,1.375 | smd 2.35 x 1.6: EP 0,0

### Placement (x,y rotation side)
3V3_LED  10.16,3.81 180 bottom
BT1  44.45,36.83 0 top
BYP  3.81,20.32 0 top
C1  10.16,15.49 0 top
C2  8.89,17.78 180 top
C3  13.97,25.15 0 top
C4  12.7,31.75 90 top
C5  13.97,5.08 270 top
C6  15.49,5.08 270 top
C7  17.02,5.08 270 top
C8  52.45,17.78 0 top
C9  54.1,10.16 270 top
C13  10.16,13.97 0 top
C46  54.1,15.24 270 top
D1  14.61,10.16 270 top
D2  10.16,31.75 0 top
D3  11.43,27.94 90 top
D4  53.34,38.1 90 top
D5  7.62,2.54 0 top
D6  50.8,38.1 90 top
D7  11.43,2.54 0 top
F2  3.81,17.78 0 top
FD1  0.76,0.76 0 top
FD2  60.2,40.01 0 top
FD3  0.76,0.76 0 bottom
FD4  60.2,40.01 0 bottom
FRAME1  3.81,-10.16 0 top  (outside the outline)
H1  58.42,38.1 0 top
H2  2.54,38.1 0 top
H3  58.42,2.54 0 top
H4  2.54,2.54 0 top
H5  44.07,14.99 0 top
H6  STAND-OFF  [STAND-OFF]  38.1,38.1 0 top
J1  6.35,10.16 270 top
J2  15.24,20.32 270 top
J3  55.88,11.43 90 top
J4  3.81,27.94 90 top
J5  34.29,1.27 0 top
J6  24.13,19.05 270 top
J7  2.54,29.21 270 top
J8  34.29,36.83 180 top
J9  54.61,1.27 0 top
J10  21.59,39.37 0 top
J11  44.45,19.05 270 top
J12  19.05,39.37 180 top
J13  25.4,3.81 0 top
J14  44.45,1.27 0 top
JP1  58.42,16.51 90 bottom
LOGO1  34.04,22.73 0 top
LOGO2  57.91,6.99 0 top
LOGO3  2.54,17.78 0 bottom
LOGO4  SFE_LOGO_NAME_FLAME.1_INCH  [SFE_LOGO_NAME_FLAME_.1]  30.48,22.86 0 bottom
LOGO5  QWIIC_LOGO_CONNECTOR  [QWIIC_5.5MM]  38.1,35.05 0 top
MEAS  10.67,6.35 180 bottom
MEAS_BATT  10.79,21.59 270 bottom
R1  59.69,16.51 90 top
R2  7.62,12.7 270 top
R3  7.62,7.62 90 top
R4  57.4,16.51 90 top
R5  12.7,10.16 270 top
R6  16.51,27.94 270 top
R7  14.99,31.75 90 top
R8  49.15,38.1 270 top
R9  15.24,15.24 90 top
R10  13.72,15.24 270 top
R11  7.62,3.81 0 top
R12  11.43,3.81 0 top
R13  50.8,7.62 0 top
R14  50.8,12.7 0 top
R15  49.15,17.78 0 top
S1  29.21,4.19 180 top
S2  21.59,4.19 180 top
U1  50.8,10.16 270 top
U2  13.97,27.94 180 top
U3  50.8,15.24 270 top
U5  10.16,10.16 0 top
U$1  [SFE_LOGO_FLAME_.1]  2.54,22.86 0 bottom
U$2  [#D1#0]  21.59,33.15 90 bottom
U$3  [#D0#0]  24.13,32.89 90 bottom
U$4  [#3V3#2]  9.27,3.81 0 bottom
U$5  [#BATT#0]  8.89,18.67 90 bottom
U$6  [#GND#0]  6.35,34.42 90 top
U$7  [#SCK#0]  16.51,34.67 90 top
U$8  [#SCK#0]  16.51,34.67 90 bottom
U$9  [#PWM1#1]  26.67,30.73 90 bottom
U$10  [#PWM0#0]  29.21,30.48 90 bottom
U$11  [MICROSD0]  47.12,34.16 0 top
U$12  [#A1#2]  31.75,33.15 90 bottom
U$13  [#A0#3]  34.29,33.02 90 bottom
U$14  [MOUNT0]  35.18,33.4 0 top
U$15  [LIPO0]  1.27,33.15 0 top
U$16  [DATA0]  31.37,19.05 0 top
U$17  [#RX1#1]  36.83,1.91 90 bottom
U$18  [#GND#0]  6.35,34.42 90 bottom
U$19  [LOGGING1]  29.72,17.4 0 top
U$20  [22220]  27.3,8.76 0 top
U$21  [#TX1#2]  39.37,1.78 90 bottom
U$22  [#I2C#0]  58.42,17.91 90 bottom
U$23  [DATA0]  37.59,18.8 0 bottom
U$24  [#GND#0]  34.29,1.78 90 top
U$25  [#G1#3V3#0]  41.91,1.78 90 bottom
U$26  [LOGGING1]  31.88,18.8 0 bottom
U$27  [#GND#0]  34.29,1.78 90 bottom
U$28  [#MEAS#3]  13.59,8.13 0 bottom
U$29  [#G2#3V3#3]  46.99,1.78 90 bottom
U$30  [#RST#0]  24.89,3.81 0 bottom
U$31  [#SDA#4]  49.53,1.91 90 bottom
U$32  [#GND#0]  44.45,1.78 90 top
U$33  [#VIN#1]  15.62,3.81 0 bottom
U$34  [#GND#0]  43.94,39.37 0 bottom
U$35  [#SCL#5]  52.07,1.91 90 bottom
U$36  [#GND#0]  44.45,1.78 90 bottom
U$37  [MICROMOD_LOGO_.35]  29.21,21.08 0 bottom
U$38  [##INT##6]  54.61,1.91 90 bottom
U$39  [#CIPO#0]  11.43,34.16 90 top
U$40  [#CIPO#0]  11.43,34.16 90 bottom
U$41  [#VE#0]  19.56,8.89 0 bottom
U$42  [#GND#0]  39.37,39.37 0 top
U$50  [##CS##0]  8.89,35.69 90 top
U$51  [##CS##0]  8.89,35.69 90 bottom
U$62  [MICROMOD_MI_LOGO_.35]  2.54,20.32 0 bottom
U$63  [MICROMOD_LOGO_.35]  35.18,20.95 0 top
U$64  [#G1_3V3#0]  19.05,32.51 90 top
U$65  [#G1_3V3#0]  19.05,32.51 90 bottom
U$66  [SFE_LOGO_FLAME_.1]  15.24,1.91 0 top
U$72  [#COPI#0]  13.97,34.04 90 top
U$73  [#COPI#0]  13.97,34.04 90 bottom
U$76  [#D1#0]  21.59,33.15 90 top
U$77  [#D0#0]  24.13,32.89 90 top
U$78  [#A0#3]  34.29,33.02 90 top
U$79  [#A1#2]  31.75,33.15 90 top
U$80  [#PWM0#0]  29.21,30.48 90 top
U$81  [#PWM1#1]  26.67,30.73 90 top
U$82  [##INT##6]  54.61,1.91 90 top
U$83  [#G2#3V3#3]  46.99,1.78 90 top
U$86  [#RX1#1]  36.83,1.91 90 top
U$87  [#SCL#5]  52.07,1.91 90 top
U$88  [#SDA#4]  49.53,1.91 90 top
U$89  [#TX1#2]  39.37,1.78 90 top
U$90  [#G1#3V3#0]  41.91,1.78 90 top
U$91  [BOOT0]  19.18,0.89 0 top
U$92  [RESET1]  26.54,0.89 0 top
U$93  [3V30]  5.46,1.27 0 top
U$94  [VIN1]  9.53,1.27 0 top
U$95  [#BYP#3]  4.57,20.32 0 top
U$96  [CHG1]  8,33.02 0 top
U$97  [SWD0]  12.7,18.03 90 top
VE  20.32,8.89 0 bottom
VIN_LED  16.51,3.81 180 bottom

### Tracks (layer width: path | path; a pad name or v marks a point on that pad's centre or on a via)
3.3V  (via drill 0.3)
  Top 0.178: v29.21,28.45 28.51,27.75 | D4.2 53.34,38.05 53.34,34.54 v50.55,31.75 | 28.7,6.86 48.64,6.86 49.15,6.35 v51.66,6.35 51.69,6.35 51.65,6.39 R13.2 | R14.2 v53.09,12.7
  Top 0.305: 28.7,25.4 28.7,27.56 28.51,27.75 28.21,28.05 J6.74 | 28.7,25.4 v28.7,16.51 28.7,10.03 | 28.7,10.03 28.68,10.05 28.61,10.05 | J6.2 28.61,10.05 | 28.7,6.86 v28.61,6.86 16.76,6.86 16.51,7.11 | 28.7,10.03 28.63,10.03 | 28.63,10.03 28.61,10.05 | 28.63,10.03 v28.61,10.03 | 28.7,25.4
  Top 0.559: 13.97,7.11 12.7,7.11 MEAS.4 | 13.97,7.11 15.49,7.11 | 15.49,7.11 16.51,7.11 17.02,7.11 C7.1 | C5.1 13.97,7.11 | C6.1 15.49,7.11
  Bottom 0.178: MEAS.2 MEAS.4 11.94,5.33 11.68,5.08 11.05,5.08 10.68,4.71 3V3_LED.2 | v50.55,31.75 50.55,28.7 49.89,28.04 29.62,28.04 v29.21,28.45 | J2.1 14.79,22.86 15.56,23.63 16.19,23.63 16.64,23.18 16.64,22.6 17.88,21.36 17.88,17.65 19.02,16.51 v28.7,16.51 | v53.09,12.7 52.58,12.7 51.82,11.94 51.82,6.5 v51.66,6.35
  Bottom 0.305: v28.61,10.03 v28.61,6.86
3.3V_EN  (via drill 0.3)
  Top 0.178: J6.4 v24.64,10.54
  Bottom 0.178: v24.64,10.54 23.11,12.06 22.35,12.06 22.06,11.77 22.06,11.31 21.21,10.46 21.21,9.63 20.73,9.14 VE.1
3.3V_EN_VE  (via drill 0.3)
  Top 0.178: v14.61,10.16 D1.C 14.61,12.19 14.48,12.32 12.7,12.32 | U5.5 11.13,12.15 11.3,12.32 12.7,12.32 | R5.1 12.7,12.32
  Bottom 0.178: VE.2 16.46,8.89 15.99,9.36 15.4,9.36 v14.61,10.16
3.3V_LP  (via drill 0.3)
  Top 0.178: J11.VCC 47.93,24.69 47.88,24.64
  Top 0.559: J10.3 J10.2 J10.1 J12.1 19.05,34.29 21.59,31.75 43.18,31.75 47.88,27.05 47.88,24.64 47.88,21.34 50.04,19.18 51.56,19.18 | 51.56,19.18 53.72,19.18 54.36,18.54 54.36,16.98 54.1,16.73 C46.1 54,16.19 52.96,16.19 | U3.5 52.96,16.19 | v52.96,15.3 52.96,16.19 | R15.2 C8.1 51.6,19.14 51.56,19.18
  Bottom 0.559: J5.4 41.91,3.43 43.56,5.08 46.48,5.08 49.78,8.38 49.78,11.3 52.96,14.48 v52.96,15.3
5V  (via drill 0.38)
  Top 0.178: D2.A 9.28,30.59 9.91,29.97 v10.67,29.97
  Top 0.559: D3.C 12.87,26.79 U2.4 13.02,25.25 | 13.02,25.25 C3.1 | 13.02,25.25 11.66,25.25 10.79,24.38 MEAS_BATT.3
  Bottom 0.178: MEAS_BATT.1 MEAS_BATT.3 10.79,29.84 v10.67,29.97
!BOOT!  (via drill 0.3)
  Top 0.178: v22.86,11.43 21.99,12.3 J6.11 | S2.4 21.59,6.1 | 21.59,6.1 S2.3 | v21.59,5.71 21.59,6.1
  Bottom 0.178: v22.86,11.43 21.59,10.16 v21.59,5.71
!RESET!  (via drill 0.3)
  Top 0.178: v27.94,11.05 J6.6 25.22,11.05 v24.89,11.38 | 29.21,6.1 S1.4 26.42,4.83 J13.1 | 29.21,6.1 S1.3 | v29.21,5.71 29.21,6.1
  Bottom 0.178: J2.10 15.88,14.14 16.39,13.63 20.03,13.63 20.45,13.21 23.06,13.21 v24.89,11.38 | v27.94,11.05 28.7,11.05 29.21,10.54 v29.21,5.71
A0  (via drill 0.3)
  Top 0.178: v34.29,30.48 33.66,29.84 27.56,29.84 27.03,30.38 23.44,30.38 22.34,29.27 22.34,27.44 23.73,26.04 23.73,19.28 24.97,18.05 J6.34
  Bottom 0.178: J8.1 v34.29,30.48
A1  (via drill 0.3)
  Top 0.178: v22.93,27.69 24.09,26.53 24.09,19.43 24.47,19.05 J6.38
  Bottom 0.178: J8.2 31.75,31.8 30.09,30.14 28.96,30.14 28.71,30.39 23.61,30.39 22.48,29.26 22.48,28.14 v22.93,27.69
CHG_LED
  Top 0.178: U2.1 14.92,30.83 R7.1
D0  (via drill 0.3)
  Top 0.178: v21.13,30.51 21.13,30.25 21.27,30.11 21.27,27 22.67,25.6 22.67,14.67 25.29,12.05 J6.10
  Bottom 0.178: v21.13,30.51 21.13,31.78 24.13,34.77 J8.5
D1  (via drill 0.3)
  Top 0.178: v20.32,31.75 20.96,31.11 21.38,31.11 21.73,30.75 21.73,29.8 21.63,29.7 21.63,27.14 23.02,25.75 23.02,15.15 24.13,14.05 J6.18
  Bottom 0.178: v20.32,31.75 20.32,33.02 21.59,34.29 J8.6
GND  (via drill 0.3)
  Top 0.178: J1.GND 7.46,13.38 R2.1 | J1.GND2 7.46,6.93 R3.1
  other vias: 7.62,5.46 11.05,7.75 10.16,10.16 11.43,10.16 8.89,10.16 15.62,8.76 17.27,9.78 13.97,2.54 15.24,2.54 16.51,2.54 16.64,14.22 12.19,15.24 11.81,17.78 7.62,14.86 15.88,29.84 7.49,25.65 7.62,33.02 27.94,18.41 20.19,19.3 20.19,20.7 20.32,17.78 55.12,8.89 53.72,22.48 40.64,34.92 24.26,15.24 21.59,15.24 36.83,9.4 36.83,6.22 29.21,2.54 21.59,2.54 9.65,1.27 44.96,36.83 17.02,12.83 22.48,9.4 13.84,30.48 16,24.51 50.8,15.24 50.8,10.16
  pour Bottom (isolate 0.178): 0,40.64 60.96,40.64 60.96,0 0,0
  pour Top (isolate 0.178): 0,40.64 60.96,40.64 60.96,0 0,0
HEADER_!CS!  (via drill 0.3)
  Top 0.178: J6.40 24.9,19.55 v24.77,19.68
  Bottom 0.178: J12.5 8.89,32.77 20.05,21.61 22.71,21.61 24.64,19.68 v24.77,19.68
I2C_!INT!  (via drill 0.3)
  Top 0.178: J6.16 27.72,13.55 v27.81,13.65
  Bottom 0.178: v27.81,13.65 28.09,13.37 28.29,13.37 29.01,12.65 33.87,12.65 40.75,19.53 58.42,19.53 58.7,19.53 59.46,19.53 60.07,18.92 60.07,8.38 59.82,8.13 59.63,7.94 54.61,2.92 J9.1
I2C_SCL  (via drill 0.3)
  Top 0.178: J14.4 52.07,1.91 58.1,7.94 58.1,11.58 57.4,12.27 57.4,12.95 | J6.14 27.77,13.05 v28.04,12.78 | R4.1 57.4,12.95 | v54.61,12.95 54.63,12.93 J3.4 57.38,12.93 57.4,12.95
  Bottom 0.178: v28.04,12.78 28.52,12.29 34.02,12.29 40.9,19.18 53.72,19.18 54.61,18.29 v54.61,12.95
I2C_SDA  (via drill 0.3)
  Top 0.178: J14.3 50.04,1.27 57.75,8.98 57.75,11.09 56.9,11.93 J3.3 54.24,11.93 v54.1,12.07 | J6.12 27.33,12.55 v27.94,11.94 | v58.04,12.7 58.04,14.73 58.97,15.66 R1.1
  Bottom 0.178: v27.94,11.94 34.16,11.94 41.02,18.8 52.96,18.8 53.98,17.78 53.98,12.2 v54.1,12.07 57.41,12.07 v58.04,12.7
N$1
  Top 0.559: U5.1 9.19,6.56 MEAS.3
  Bottom 0.178: MEAS.3 MEAS.1
N$2  (via drill 0.3)
  Top 0.178: R4.2 56.35,18.41 v56.01,18.41
  Bottom 0.178: v56.01,18.41 58.17,18.41 58.42,18.16 JP1.3
N$3  (via drill 0.3)
  Top 0.178: R1.2 59.69,18.03 v59.3,18.43
  Bottom 0.178: v59.3,18.43 59.3,18.02 59.32,17.99 59.32,15.69 59.16,15.53 58.48,15.53 JP1.1
N$4
  Top 0.178: R7.2 14.99,33.66 14.61,34.04 11.43,34.04 11.04,33.64 D2.C
N$5
  Top 0.178: R11.1 6.74,3.78 D5.A
N$6  (via drill 0.3)
  Top 0.178: R11.2 8.47,5.04 v8.51,5.08
  Bottom 0.178: v8.51,5.08 8.51,4.06 8.76,3.81 3V3_LED.1
N$7
  Top 0.178: U2.5 16.06,26.64 R6.2
N$8  (via drill 0.3)
  Top 0.178: R12.2 12.28,4.41 v12.95,5.08
  Bottom 0.178: v12.95,5.08 12.95,4.19 13.34,3.81 VIN_LED.1
N$9
  Top 0.178: R12.1 10.55,3.78 D7.A
N$10
  Top 0.178: J1.A5 7.18,11.41 R2.2
N$11
  Top 0.178: J1.B5 7.56,8.41 R3.2
N$14
  Top 0.178: BT1.+ 46.56,38.95 R8.1 49.45,39.25 D6.A
PERIPHERAL_PWR_CTRL  (via drill 0.3)
  Top 0.178: J6.42 27.3,20.05 v27.93,19.42 | v38.77,14.57 31.79,14.57 v31.75,14.61 | U3.3 49.5,13.75 49.95,13.3 R14.1 v48.79,12.7
  Bottom 0.178: v27.93,19.42 31.75,15.6 v31.75,14.61 | v48.79,12.7 48.5,12.7 46.85,11.05 42.29,11.05 v38.77,14.57
PWM0  (via drill 0.3)
  Top 0.178: v29.21,30.73 23.17,30.73 21.98,29.55 21.98,27.29 23.38,25.89 23.38,19.14 24.88,17.64 24.88,17.63 24.97,17.55 J6.32
  Bottom 0.178: v29.21,30.73 J8.3
PWM1  (via drill 0.3)
  Top 0.178: v20.19,26.92 20.84,26.92 22.31,25.45 22.31,22.35 21.26,21.3 J6.47
  Bottom 0.178: v20.19,26.92 20.19,27.94 26.67,34.42 J8.4
QWIIC_PWR  (via drill 0.3)
  Top 0.178: J3.2 56.76,10.93 v57.15,10.54
  Top 0.559: J3.2 54.18,10.93 C9.1 54,11.11 53.09,11.11 | U1.5 53.09,11.11 | v53.09,10.47 53.09,11.11
  Bottom 0.178: JP1.2 57.61,16.51 57.26,16.16 57.26,14.65 58.64,13.28 58.64,11.82 57.36,10.54 v57.15,10.54
  Bottom 0.559: J14.2 48.9,3.17 50.93,3.17 53.09,5.33 v53.09,10.47
QWIIC_PWR_CTRL  (via drill 0.3)
  Top 0.178: J6.44 27.65,20.55 v27.94,20.26 | v33.02,13.97 38.1,13.97 v42.8,9.27 | R13.1 49.95,8.22 49.5,8.67 U1.3 48.45,9.21 v48.39,9.27
  Bottom 0.178: v27.94,20.26 33.02,15.18 v33.02,13.97 | v48.39,9.27 v42.8,9.27
RTC_3V  (via drill 0.3)
  Top 0.178: v44.32,29.21 26.04,29.21 25.15,28.32 25.15,27.69 25.28,27.55 J6.72 | v47.94,29.15 49.15,30.35 R8.2 49.74,37.25 50.05,36.95 D6.C 50.8,37.72 51.18,38.1 D4.3
  Bottom 0.178: v44.32,29.21 47.88,29.21 v47.94,29.15
RX1  (via drill 0.3)
  Top 0.178: v20.45,14.17 20.32,14.3 J6.19
  Bottom 0.178: v20.45,14.17 20.8,14.17 21.41,13.56 23.6,13.56 27.18,9.99 27.18,4.57 27.94,3.81 35.56,3.81 36.83,2.54 J5.2
SD_!CS!  (via drill 0.3)
  Top 0.178: J11.CS/DAT3 52.99,26.89 v52.83,27.05 | R15.1 47.88,17.78 46.23,19.43 v46.23,26.54 | J6.55 19.8,23.3 19.95,23.15 20.32,23.15 20.44,23.15 21.23,23.15 21.96,23.88 21.96,25.29 21.34,25.91 v20.32,25.91
  Bottom 0.178: 46.23,27.05 v52.83,27.05 | v46.23,26.54 46.23,27.05 | v20.32,25.91 21.46,27.05 46.23,27.05
SPI_CIPO  (via drill 0.3)
  Top 0.178: J11.DO/DAT0 53.01,21.39 v52.83,21.21 | J6.61 17.7,24.8 v17.32,25.19
  Bottom 0.178: J12.4 11.43,30.73 16.97,25.19 | v52.83,21.21 25.65,21.21 24.83,22.04 v24.77,21.97 20.19,21.97 16.97,25.19 | v17.32,25.19 16.97,25.19
SPI_COPI  (via drill 0.3)
  Top 0.178: J11.DI/CMD 52.84,25.79 v52.83,25.78 | J12.3 13.97,36.2 v17.4,32.77 | J6.59 19.73,24.3 v20.45,25.02
  Bottom 0.178: v52.83,25.78 29.21,25.78 28.7,25.78 v27.94,25.02 v20.45,25.02 20.19,25.02 17.78,27.43 17.78,32.38 v17.4,32.77
SPI_SCK  (via drill 0.3)
  Top 0.178: J11.SCLK 52.86,23.59 v52.83,23.62 | J6.57 20.14,23.8 v20.19,23.75
  Bottom 0.178: J12.2 16.51,27.43 v20.19,23.75 20.32,23.62 v52.83,23.62
SWDCK  (via drill 0.3)
  Top 0.178: J6.21 17.8,14.8 17.77,14.77 17.11,14.77 v16.64,15.24
  Bottom 0.178: v16.64,15.24 16.64,15.62 17.17,16.15 17.17,20.3 J2.4
SWDIO  (via drill 0.3)
  Top 0.178: J6.23 17.59,15.3 v17.53,15.37
  Bottom 0.178: v17.53,15.37 17.53,21.21 J2.2
TX1  (via drill 0.3)
  Top 0.178: v21.59,14.22 20.94,13.58 20.2,13.58 19.98,13.8 J6.17
  Bottom 0.178: v21.59,14.22 21.64,14.17 23.5,14.17 27.56,10.11 27.56,4.7 28.09,4.17 37.74,4.17 39.37,2.54 J5.3
USB_D+  (via drill 0.3)
  Top 0.178: J1.A6 5.2,10.41 v4.95,10.16 4.95,9.65 5.2,9.41 J1.B6 | v20.57,10.21 20.48,10.3 J6.3
  Bottom 0.178: v4.95,10.16 4.99,10.2 7.36,10.2 8.36,11.2 19.59,11.2 v20.57,10.21
USB_D-  (via drill 0.3)
  Top 0.178: J1.B7 6.99,10.91 v7.11,10.79 7.11,10.16 6.86,9.91 J1.A7 | v20.7,11.05 20.45,10.8 J6.5
  Bottom 0.178: v20.7,11.05 20.2,11.55 7.87,11.55 v7.11,10.79
V_BATT
  Top 0.559: J7.1 2.81,28.94 J4.2 11.28,28.94 D3.A 12.57,29.09 | 12.57,29.09 12.87,29.09 U2.3 | C4.1 12.7,29.22 12.57,29.09
V_USB
  Top 0.406: J1.VBUS2 5.46,7.71 5.2,7.98 3.58,7.98 2.79,8.76 | J1.VBUS1 5.46,12.61 5.2,12.34 2.95,12.34 2.79,12.19
  Top 0.559: BYP.1 2.92,20.32 2.31,19.71 F2.1 2.31,15.72 2.79,15.24 2.79,12.19 2.79,8.76
VIN  (via drill 0.3)
  Top 0.178: R10.2 13.72,12.95 | R5.2 12.7,8.13 12.95,7.87 13.59,7.87 | 16.45,11.81 16.46,11.8 J6.9 | v13.59,8.38 13.59,7.87 | 16.45,7.91 16.41,7.87 13.59,7.87
  Top 0.559: BYP.2 5.33,20.32 | 5.33,20.32 5.31,20.3 F2.2 C2.+ 7.49,16.39 8.38,15.49 C1.1 C13.1 9.19,13.85 9.19,12.95 | U5.8 9.19,12.95 | 9.19,12.95 13.72,12.95 15.62,12.95 16.45,12.13 16.45,11.81 16.45,7.91 16.51,7.85 17.32,7.85 17.7,7.47 28.11,7.47 28.29,7.64 45.62,7.64 47.88,9.91 47.88,11.05 | 5.33,20.32 MEAS_BATT.4 | U3.1 48.58,16.19 47.88,15.49 47.88,11.05 | U1.1 47.94,11.11 47.88,11.05
  Bottom 0.178: MEAS_BATT.2 MEAS_BATT.4 | VIN_LED.2 17.03,4.81 16.76,5.08 14.22,5.08 13.59,5.71 v13.59,8.38
VIN/3
  Top 0.178: R10.1 R9.2 16.22,16.09 16.79,16.66 16.79,21.31 17.27,21.8 J6.49

### Text on the board
Bottom: v12
tPlace: + | - | + | -
bPlace: + | -
tDocu: N. Seidle